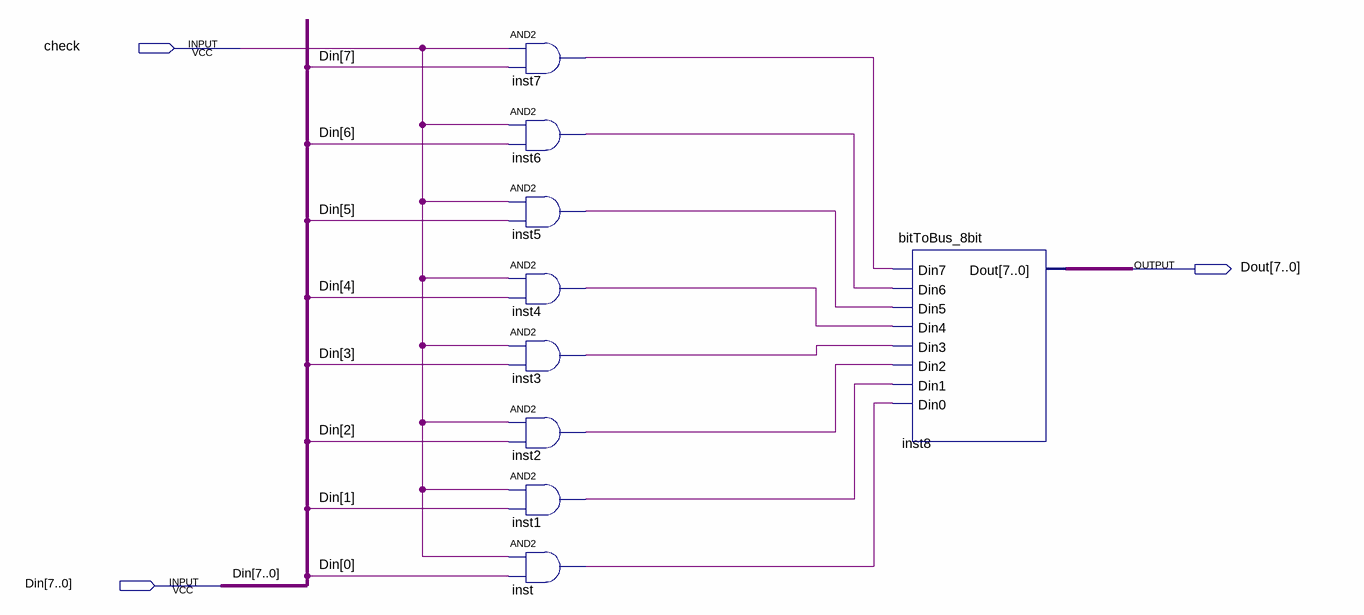
[diagram p0: schematic sheet]
// Quartus schematic and_8bit_2bit.bdf as structural Verilog: 9 symbols, 3 pins
module and_8bit_2bit (
  input  check,
  input  [7:0] Din,
  output [7:0] Dout
);

  wire inst1_out, inst2_out, inst3_out, inst4_out, inst5_out, inst6_out, inst7_out, inst_out;

  and inst7 (inst7_out, check, Din[7]);
  and inst6 (inst6_out, check, Din[6]);
  and inst5 (inst5_out, check, Din[5]);
  and inst4 (inst4_out, check, Din[4]);
  and inst3 (inst3_out, check, Din[3]);
  and inst2 (inst2_out, check, Din[2]);
  and inst1 (inst1_out, check, Din[1]);
  and inst (inst_out, check, Din[0]);
  bitToBus_8bit inst8 (
    .Din7(inst7_out), .Din6(inst6_out), .Din5(inst5_out), .Din4(inst4_out), .Din3(inst3_out),
    .Din2(inst2_out), .Din1(inst1_out), .Din0(inst_out), .Dout(Dout));
endmodule
